# Altium schematic sheet main.SchDoc
size A2; SheetNumber: 1; SheetTotal: 4
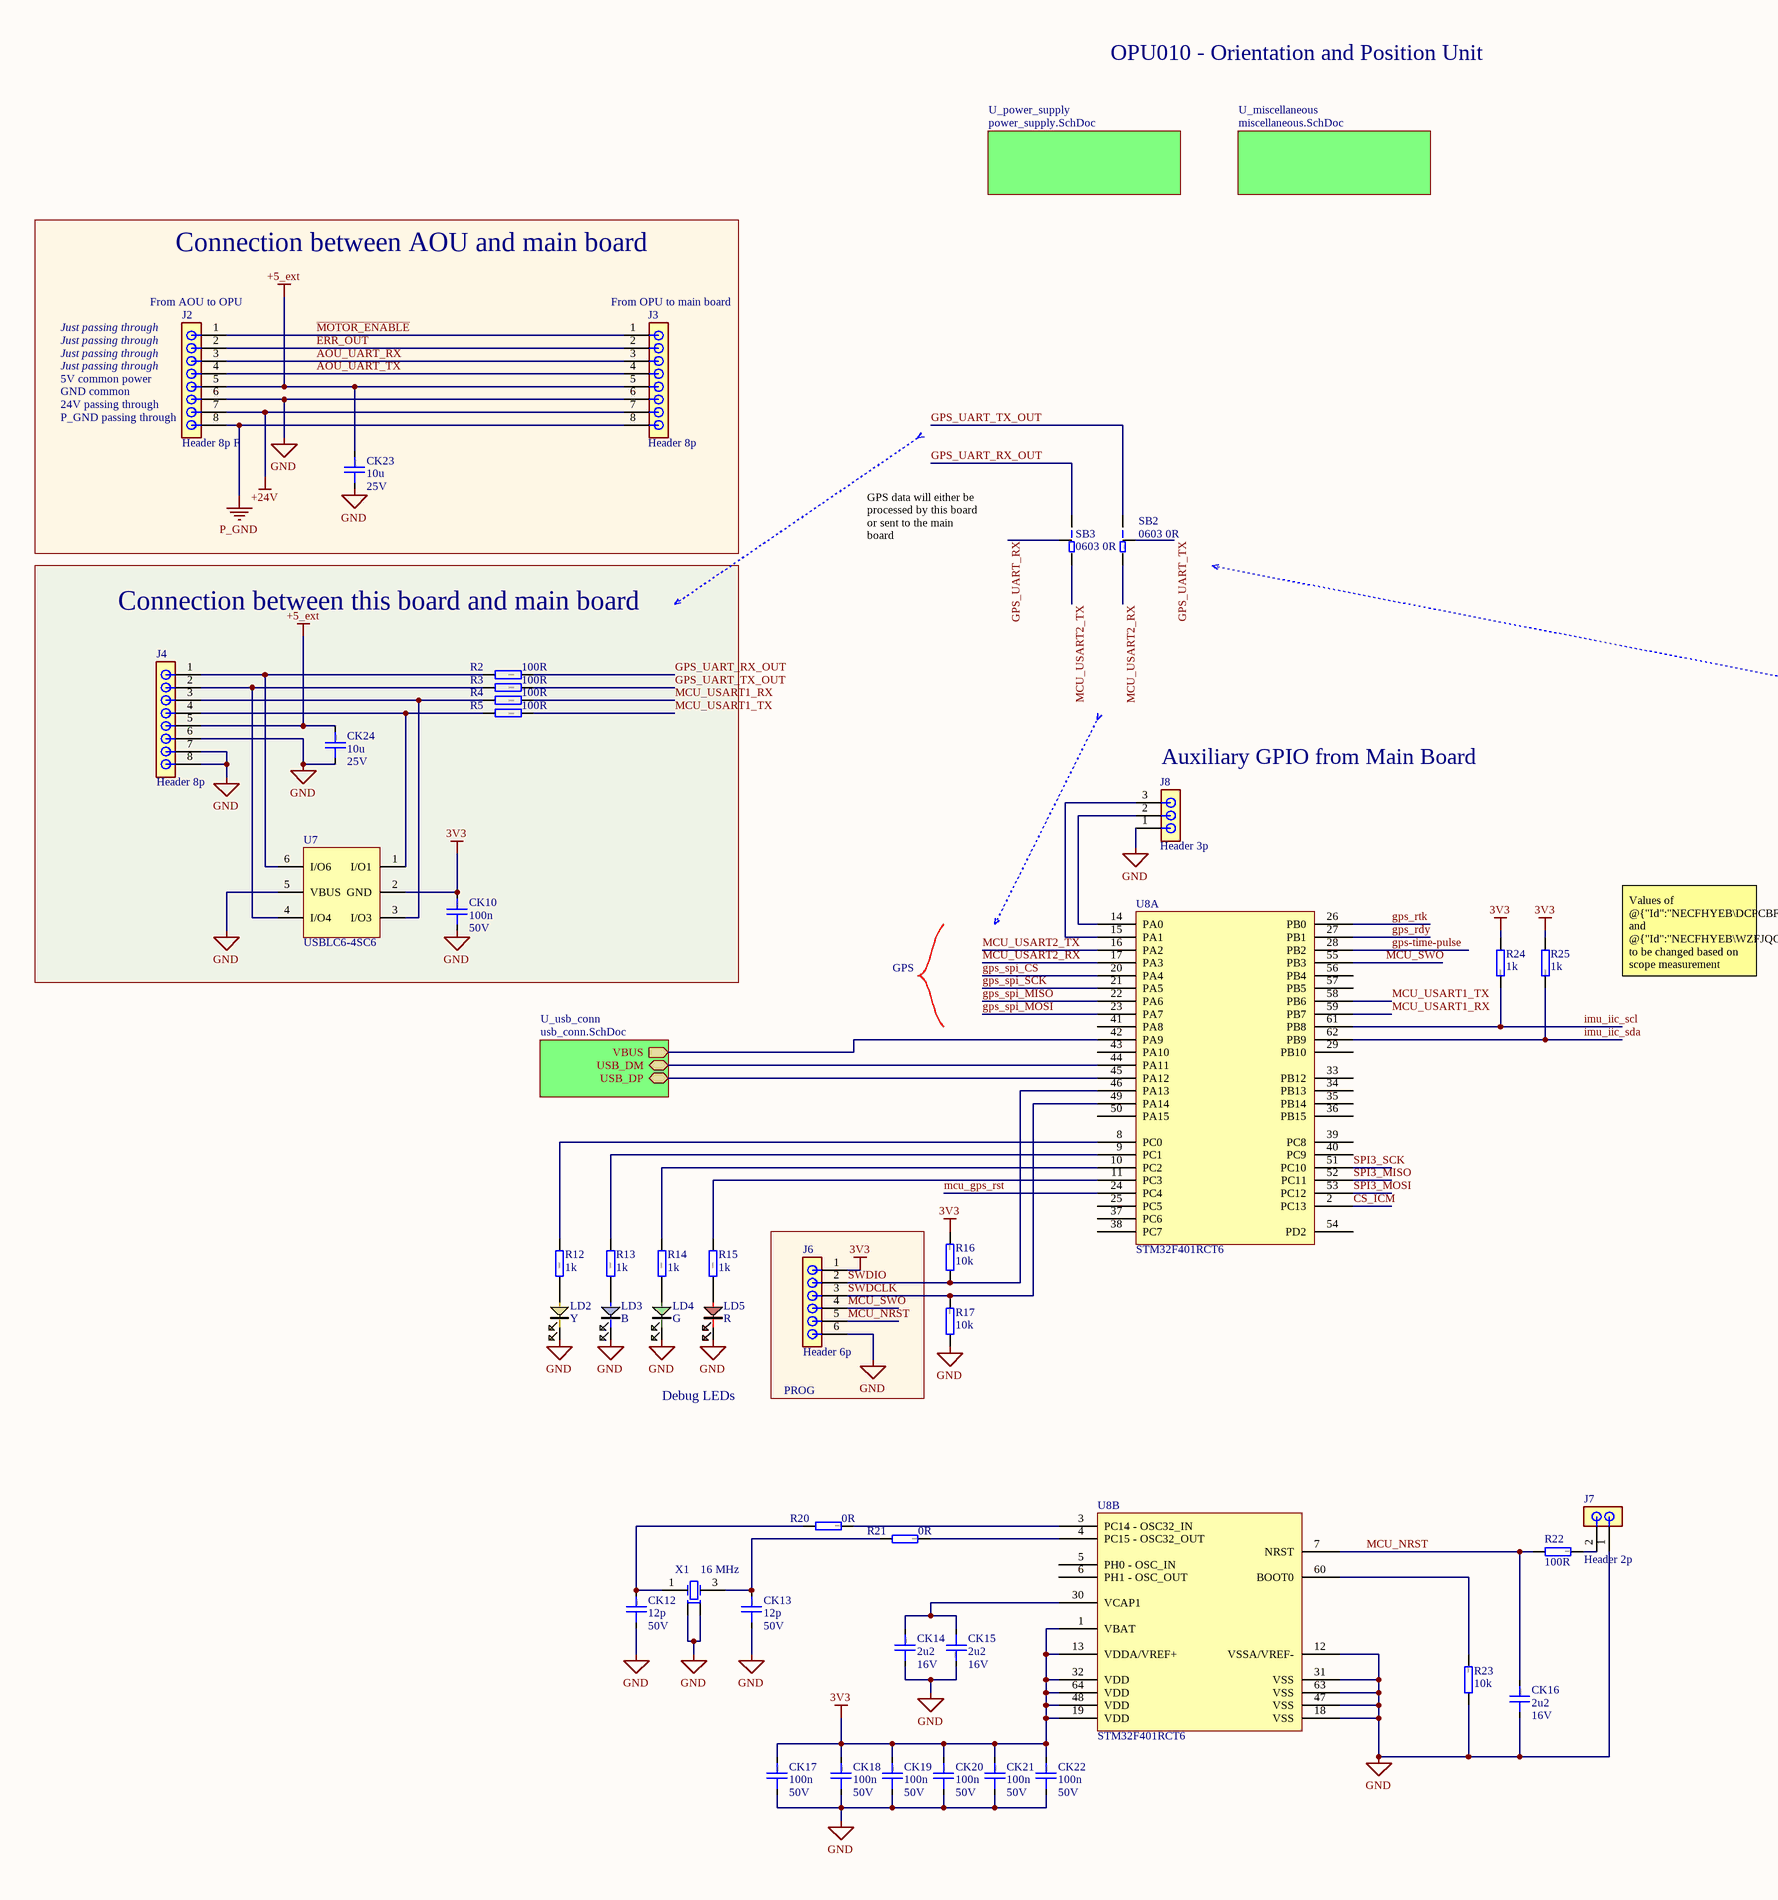
[diagram p0: main.SchDoc, left]
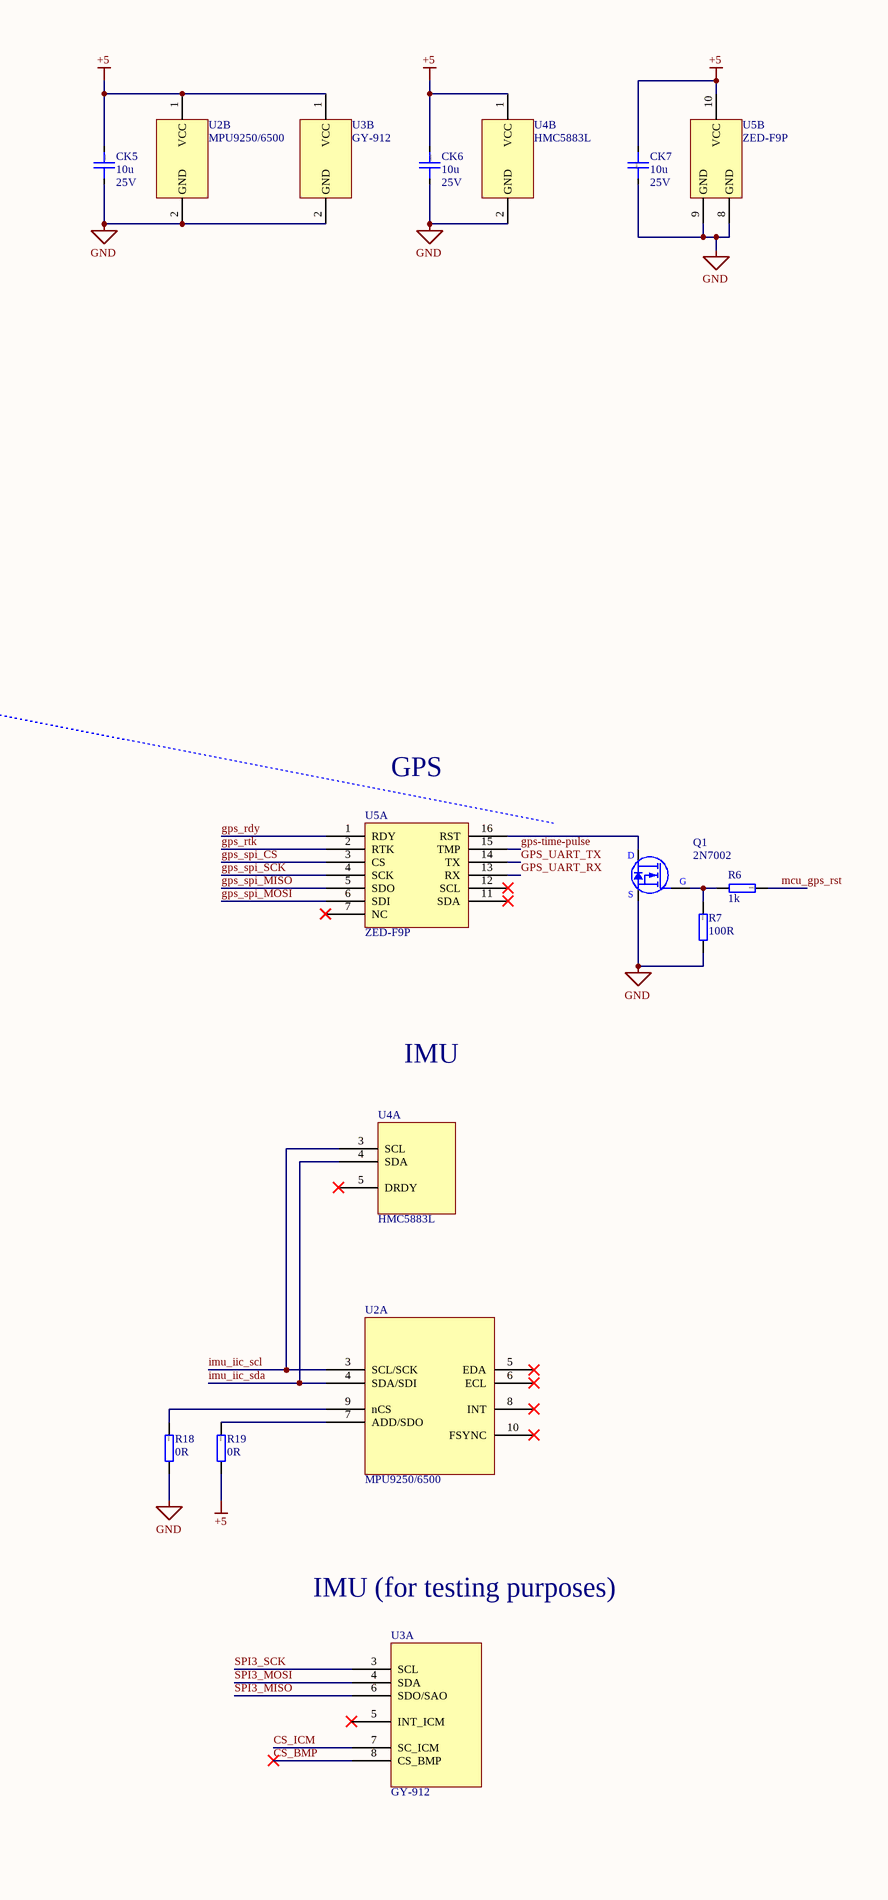
[diagram p1: main.SchDoc, right]

## Parts
CK5  10u  Voltage rating: 25V  [CAP0805]
CK6  10u  Voltage rating: 25V  [CAP0805]
CK7  10u  Voltage rating: 25V  [CAP0805]
CK10  100n  Voltage rating: 50V  [CAP0603]
CK12  12p  Voltage rating: 50V  [CAP0603]
CK13  12p  Voltage rating: 50V  [CAP0603]
CK14  2u2  Voltage rating: 16V  [CAP0603]
CK15  2u2  Voltage rating: 16V  [CAP0603]
CK16  2u2  Voltage rating: 16V  [CAP0603]
CK17  100n  Voltage rating: 50V  [CAP0603]
CK18  100n  Voltage rating: 50V  [CAP0603]
CK19  100n  Voltage rating: 50V  [CAP0603]
CK20  100n  Voltage rating: 50V  [CAP0603]
CK21  100n  Voltage rating: 50V  [CAP0603]
CK22  100n  Voltage rating: 50V  [CAP0603]
CK23  10u  Voltage rating: 25V  [CAP0805]
CK24  10u  Voltage rating: 25V  [CAP0805]
J2  Header 8p F  [Pin header 8p - F]
J3  Header 8p  [Pin header 8p]
J4  Header 8p  [Pin header 8p]
J6  Header 6p  [Pin header 6p]
J7  Header 2p  [Pin header 2p]
J8  Header 3p  [Pin header 3p]
LD2  Y  [0603_LED_Y]
LD3  B  [0603_LED_B]
LD4  G  [0603_LED_G]
LD5  R  [0603_LED_R]
Q1  2N7002  [SOT95P230X110-3N(SOT23)]
R2  100R  [RESC2012X06N(SMR0805)]
R3  100R  [RESC2012X06N(SMR0805)]
R4  100R  [RESC2012X06N(SMR0805)]
R5  100R  [RESC2012X06N(SMR0805)]
R6  1k  [RESC2012X06N(SMR0805)]
R7  100R  [RESC2012X06N(SMR0805)]
R12  1k  [RESC2012X06N(SMR0805)]
R13  1k  [RESC2012X06N(SMR0805)]
R14  1k  [RESC2012X06N(SMR0805)]
R15  1k  [RESC2012X06N(SMR0805)]
R16  10k  [RESC2012X06N(SMR0805)]
R17  10k  [RESC2012X06N(SMR0805)]
R18  0R  [RESC2012X06N(SMR0805)]
R19  0R  [RESC2012X06N(SMR0805)]
R20  0R  [RESC2012X06N(SMR0805)]
R21  0R  [RESC2012X06N(SMR0805)]
R22  100R  [RESC2012X06N(SMR0805)]
R23  10k  [RESC2012X06N(SMR0805)]
R24  1k  [RESC2012X06N(SMR0805)]
R25  1k  [RESC2012X06N(SMR0805)]
SB2  0603 0R  [Solder T bridge 0603]
SB3  0603 0R  [Solder T bridge 0603]
U2  MPU9250/6500  [devboard MPU9250/6500]  (parts A,B of 2)
U3  GY-912  [devboard GY-912]  (parts A,B of 2)
U4  HMC5883L  [devboard HMC5883L]  (parts A,B of 2)
U5  ZED-F9P  [devboard gnss rtk click]  (parts A,B of 2)
U7  USBLC6-4SC6  [SOT23-6]
U8  STM32F401RCT6  [LQFP64]  (parts A,B of 2)
X1  16 MHz  [3225 XTal]

## Blocks framed on the sheet
Connection between AOU and main board: CK23 J2 J3
Connection between this board and main board: CK10 CK24 J4 R2-R5 U7
PROG: J6

## Sub-sheets
U_miscellaneous = miscellaneous.SchDoc: no entries
U_power_supply = power_supply.SchDoc: no entries
U_usb_conn = usb_conn.SchDoc: USB_DM (bidir), USB_DP (bidir), VBUS (out)

## Nets
3V3: CK10.1 CK17.1 CK18.1 CK19.1 CK20.1 CK21.1 CK22.1 J6.1 R16.2 R24.1 R25.1 U7.2(GND) U8.1(VBAT) U8.13(VDDA/VREF+) U8.19(VDD) U8.32(VDD) U8.48(VDD) U8.64(VDD)
+5: CK5.1 CK6.1 CK7.1 R19.1 U2.1(VCC) U3.1(VCC) U4.1(VCC) U5.10(VCC)
+5_ext: CK23.1 CK24.1 J2.5 J3.5 J4.5
+24V: J2.7 J3.7
GND: CK5.2 CK6.2 CK7.2 CK10.2 CK12.2 CK13.2 CK14.2 CK15.1 CK16.2 CK17.2 CK18.2 CK19.2 CK20.2 CK21.2 CK22.2 CK23.2 CK24.2 J2.6 J3.6 J4.6 J4.7 J4.8 J6.6 J7.1 J8.1 LD2.2 LD3.2 LD4.2 LD5.2 Q1.2(S) R7.1 R17.1 R18.1 R23.1 U2.2(GND) U3.2(GND) U4.2(GND) U5.8(GND) U5.9(GND) U7.5(VBUS) U8.12(VSSA/VREF-) U8.18(VSS) U8.31(VSS) U8.47(VSS) U8.63(VSS) X1.2 X1.4
P_GND: J2.8 J3.8
~{MOTOR_ENABLE}: J2.1 J3.1
AOU_UART_RX: J2.3 J3.3
AOU_UART_TX: J2.4 J3.4
CS_BMP: U3.8(CS_BMP)
CS_ICM: U3.7(SC_ICM) U8.2(PC13)
ERR_OUT: J2.2 J3.2
gps-time-pulse: U5.15(TMP) U8.28(PB2)
gps_rdy: U5.1(RDY) U8.27(PB1)
gps_rtk: U5.2(RTK) U8.26(PB0)
gps_spi_CS: U5.3(CS) U8.20(PA4)
gps_spi_MISO: U5.5(SDO) U8.22(PA6)
gps_spi_MOSI: U5.6(SDI) U8.23(PA7)
gps_spi_SCK: U5.4(SCK) U8.21(PA5)
GPS_UART_RX: SB3.2 U5.13(RX)
GPS_UART_RX_OUT: R2.2 SB3.1
GPS_UART_TX: SB2.2 U5.14(TX)
GPS_UART_TX_OUT: R3.2 SB2.1
imu_iic_scl: R24.2 U2.3(SCL/SCK) U4.3(SCL) U8.61(PB8)
imu_iic_sda: R25.2 U2.4(SDA/SDI) U4.4(SDA) U8.62(PB9)
mcu_gps_rst: R6.2 U8.24(PC4)
MCU_NRST: CK16.1 J6.5 R22.1 U8.7(NRST)
MCU_SWO: J6.4 U8.55(PB3)
MCU_USART1_RX: R4.2 U8.59(PB7)
MCU_USART1_TX: R5.2 U8.58(PB6)
MCU_USART2_RX: SB2.3 U8.17(PA3)
MCU_USART2_TX: SB3.3 U8.16(PA2)
SPI3_MISO: U3.6(SDO/SAO) U8.52(PC11)
SPI3_MOSI: U3.4(SDA) U8.53(PC12)
SPI3_SCK: U3.3(SCL) U8.51(PC10)
SWDCLK: J6.3 R17.2 U8.49(PA14)
SWDIO: J6.2 R16.1 U8.46(PA13)
NetCK12_1: CK12.1 R20.1 X1.1
NetCK13_1: CK13.1 R21.1 X1.3
NetCK14_1: CK14.1 CK15.2 U8.30(VCAP1)
NetJ4_1: J4.1 R2.1 U7.6(I/O6)
NetJ4_2: J4.2 R3.1 U7.4(I/O4)
NetJ4_3: J4.3 R4.1 U7.3(I/O3)
NetJ4_4: J4.4 R5.1 U7.1(I/O1)
NetJ7_2: J7.2 R22.2
NetJ8_2: J8.2 U8.14(PA0)
NetJ8_3: J8.3 U8.15(PA1)
NetLD2_1: LD2.1 R12.2
NetLD3_1: LD3.1 R13.2
NetLD4_1: LD4.1 R14.2
NetLD5_1: LD5.1 R15.2
NetQ1_1: Q1.1(G) R6.1 R7.2
NetQ1_3: Q1.3(D) U5.16(RST)
NetR12_1: R12.1 U8.8(PC0)
NetR13_1: R13.1 U8.9(PC1)
NetR14_1: R14.1 U8.10(PC2)
NetR15_1: R15.1 U8.11(PC3)
NetR18_2: R18.2 U2.9(nCS)
NetR19_2: R19.2 U2.7(ADD/SDO)
NetR20_2: R20.2 U8.3(PC14_-_OSC32_IN)
NetR21_2: R21.2 U8.4(PC15_-_OSC32_OUT)
NetR23_2: R23.2 U8.60(BOOT0)
NetU8_42: U8.42(PA9) ; sheet U_usb_conn/VBUS
NetU8_44: U8.44(PA11) ; sheet U_usb_conn/USB_DM
NetU8_45: U8.45(PA12) ; sheet U_usb_conn/USB_DP

Not connected (* = marked no-connect by the designer): U2 5(EDA)* 6(ECL)* 8(INT)* 10(FSYNC)*; U3 5(INT_ICM)*; U4 5(DRDY)*; U5 7(NC)* 11(SDA)* 12(SCL)*; U8 5(PH0_-_OSC_IN) 6(PH1_-_OSC_OUT) 25(PC5) 29(PB10) 33(PB12) 34(PB13) 35(PB14) 36(PB15) 37(PC6) 38(PC7) 39(PC8) 40(PC9) 41(PA8) 43(PA10) 50(PA15) 54(PD2) 56(PB4) 57(PB5)

## Notes on the sheet
- OPU010 - Orientation and Position Unit
- (near J2) Just passing through
- (near J2) From AOU to OPU
- (near J3) From OPU to main board
- 5V common power
- GND common
- (near J2) 24V passing through
- (near J2) P_GND passing through
- GPS data will either be processed by this board or sent to the main board
- (near J8) Auxiliary GPIO from Main Board
- GPS
- Values of @{"Id":"NECFHYEB\DCPCBFJP","ObjectType":2} and @{"Id":"NECFHYEB\WZFJQOTN","ObjectType":2} to be changed based on scope measurement
- IMU
- Debug LEDs
- IMU (for testing purposes)
- (in symbol 0R T-junction) 0R
- (in symbol Cap 2u2 0603) 0603
- (in symbol Cap 10u 0805) 0805
- (in symbol Cap 12p 0603) 0603
- (in symbol Cap 100n 0603) 0603

## Library data of the parts
CK5-CK7 CK23 CK24 = Cap 10u 0805: 25V 10uF X5R ±10% 0805 Multilayer Ceramic Capacitors MLCC - SMD/SMT ROHS; Basic: Yes; JLCPCB Part: C15850; Value: 10u
CK10 CK17-CK22 = Cap 100n 0603: 50V 100nF X7R ±10% 0603 Multilayer Ceramic Capacitors MLCC - SMD/SMT ROHS; Basic: Yes; Value: 100n; JLCPCB Part: C14663
CK12 CK13 = Cap 12p 0603: 50V 12pF C0G ±5% 0603 Multilayer Ceramic Capacitors MLCC - SMD/SMT ROHS; Basic: Yes; Value: 12p; JLCPCB Part: C38523
CK14-CK16 = Cap 2u2 0603: 16V 2.2uF X5R ±10% 0603 Multilayer Ceramic Capacitors MLCC - SMD/SMT ROHS; Basic: Yes; Value: 2u2; JLCPCB Part: C23630
J2 = Pin header 8p_F: 3A Direct Insert Policy 6P -40℃~+105℃ 2.54mm Single Row Black Brass 1x6P Plugin,P=2.54mm Pin Headers ROHS; Manufacturer_Name: Connfly; Manufacturer_Part_Number: DS1021-1*2SF11-B; Datasheet Link: https://www.tme.com/Document/cc301e58a5da78cb543a94b5a5b7f06a/DS1021.pdf; Height: 5.88mm
J3 J4 = Pin header 8p: 3A Direct Insert Policy 6P -40℃~+105℃ 2.54mm Single Row Black Brass 1x6P Plugin,P=2.54mm Pin Headers ROHS; Manufacturer_Name: Connfly; Manufacturer_Part_Number: DS1021-1*2SF11-B; Datasheet Link: https://www.tme.com/Document/cc301e58a5da78cb543a94b5a5b7f06a/DS1021.pdf; Height: 5.88mm; JLCPCB Part: C37208
J6 = Pin header 6p: 3A Direct Insert Policy 6P -40℃~+105℃ 2.54mm Single Row Black Brass 1x6P Plugin,P=2.54mm Pin Headers ROHS; Manufacturer_Name: Connfly; Manufacturer_Part_Number: DS1021-1*2SF11-B; Datasheet Link: https://www.tme.com/Document/cc301e58a5da78cb543a94b5a5b7f06a/DS1021.pdf; Height: 5.88mm; JLCPCB Part: C37208
J7 = Pin header 2p: Connector; Manufacturer_Name: Connfly; Manufacturer_Part_Number: DS1021-1*2SF11-B; Basic: No; Datasheet Link: https://www.tme.com/Document/cc301e58a5da78cb543a94b5a5b7f06a/DS1021.pdf; Height: 5.88mm; JLCPCB Part: C492401
J8 = Pin header 3p: Direct Insert 2.54mm Policy 3A 2.5mm -40℃~+105℃ 3mm 6mm 250V Black 1x3P Single Row 3P Pin Headers; Manufacturer_Name: Connfly; Manufacturer_Part_Number: DS1021-1*2SF11-B; Basic: No; Datasheet Link: https://www.tme.com/Document/cc301e58a5da78cb543a94b5a5b7f06a/DS1021.pdf; Height: 5.88mm; JLCPCB Part: C2937625
LD2 = LED Y 0603: 0603 Yellow Led; JLCPCB Part: C7496811
LD3 = LED B 0603: 0603 Blue Led; JLCPCB Part: C7496819
LD4 = LED G 0603: 0603 Green Led; JLCPCB Part: C22371297
LD5 = LED R 0603: -40℃~+85℃ Red 0603 LED Indication - Discrete ROHS; JLCPCB Part: C2286
Q1 = 2N7002: 60V 115mA 200mW 7.5Ω@10V,500mA 2.5V@250uA 1 N-Channel SOT-23 MOSFETs ROHS; Basic: Yes; JLCPCB Part: C8545
R2-R5 R7 R22 = Res 100R 0805: 125mW Thick Film Resistors 150V ±100ppm/℃ ±1% 100Ω 0805 Chip Resistor - Surface Mount ROHS; Tolerance & Rating: 1%/0.1W; Basic: Yes; Value: 100R; Package: 0805; Author: JP/27.03.2014; SMD: 1; ComponentLink3Description: rezistor čip; ComponentLink3URL: heliosgreen://v1/hegMT/5-MT/Classes(343)/Folders/OpenForm?RecordNumbers=[381513]; JLCPCB Part: C17408
R6 R12-R15 R24 R25 = Res 1k 0805: 125mW Thick Film Resistors 150V ±100ppm/℃ ±1% 1kΩ 0805 Chip Resistor - Surface Mount ROHS; Tolerance & Rating: 1%/0.1W; Basic: Yes; Value: 1k; Package: 0805; Author: JP/27.03.2014; SMD: 1; ComponentLink3Description: rezistor čip; ComponentLink3URL: heliosgreen://v1/hegMT/5-MT/Classes(343)/Folders/OpenForm?RecordNumbers=[381513]; JLCPCB Part: C17513
R16 R17 R23 = Res 10k 0805: 125mW Thick Film Resistors 150V ±100ppm/℃ ±1% 10kΩ 0805 Chip Resistor - Surface Mount ROHS; Tolerance & Rating: 1%/0.1W; Basic: Yes; Value: 10k; Package: 0805; SMD: 1; ComponentLink3Description: rezistor čip; ComponentLink3URL: heliosgreen://v1/hegMT/5-MT/Classes(343)/Folders/OpenForm?RecordNumbers=[381513]; JLCPCB Part: C17414
R18-R21 = Res 0R 0805: 125mW Thick Film Resistors 150V ±800ppm/℃ ±1% 0Ω 0805 Chip Resistor - Surface Mount ROHS; Tolerance & Rating: 1%/0.1W; Basic: YES; Value: 0R; Package: 0805; Author: JP/27.03.2014; SMD: 1; ComponentLink3Description: rezistor čip; ComponentLink3URL: heliosgreen://v1/hegMT/5-MT/Classes(343)/Folders/OpenForm?RecordNumbers=[381513]; JLCPCB Part: C17477
SB2 SB3 = 0R T-junction: Basic: Yes; JLCPCB Part: C21189
U2 = devboard MPU9250/6500: Module, MPU9250/6500
U3 = devboard GY-912
U4 = devboard HMC5883L
U5 = devboard ZED-F9P: devboard GNSS RTK click
U7 = USBLC6-4SC6: 5A 17V 6V Unidirectional 5.25V SOT-23-6 ESD and Surge Protection (TVS/ESD) ROHS; Basic: No; JLCPCB Part: C111212
U8 = STM32F401RCT6: 256KB 1.7V~3.6V ARM-M4 64KB 84MHz FLASH 50 LQFP-64(10x10) Microcontrollers (MCU/MPU/SOC) ROHS; Basic: No; JLCPCB Part: C74524
X1 = 16 MHz crystal: X322516MLB4SI / 16MHz Surface Mount Crystal 9pF ±10ppm ±20ppm SMD3225-4P Crystals ROHS; Basic: Yes; JLCPCB: C13738